# EAGLE schematic ControlModule-pan (EAGLE 7.2.0)
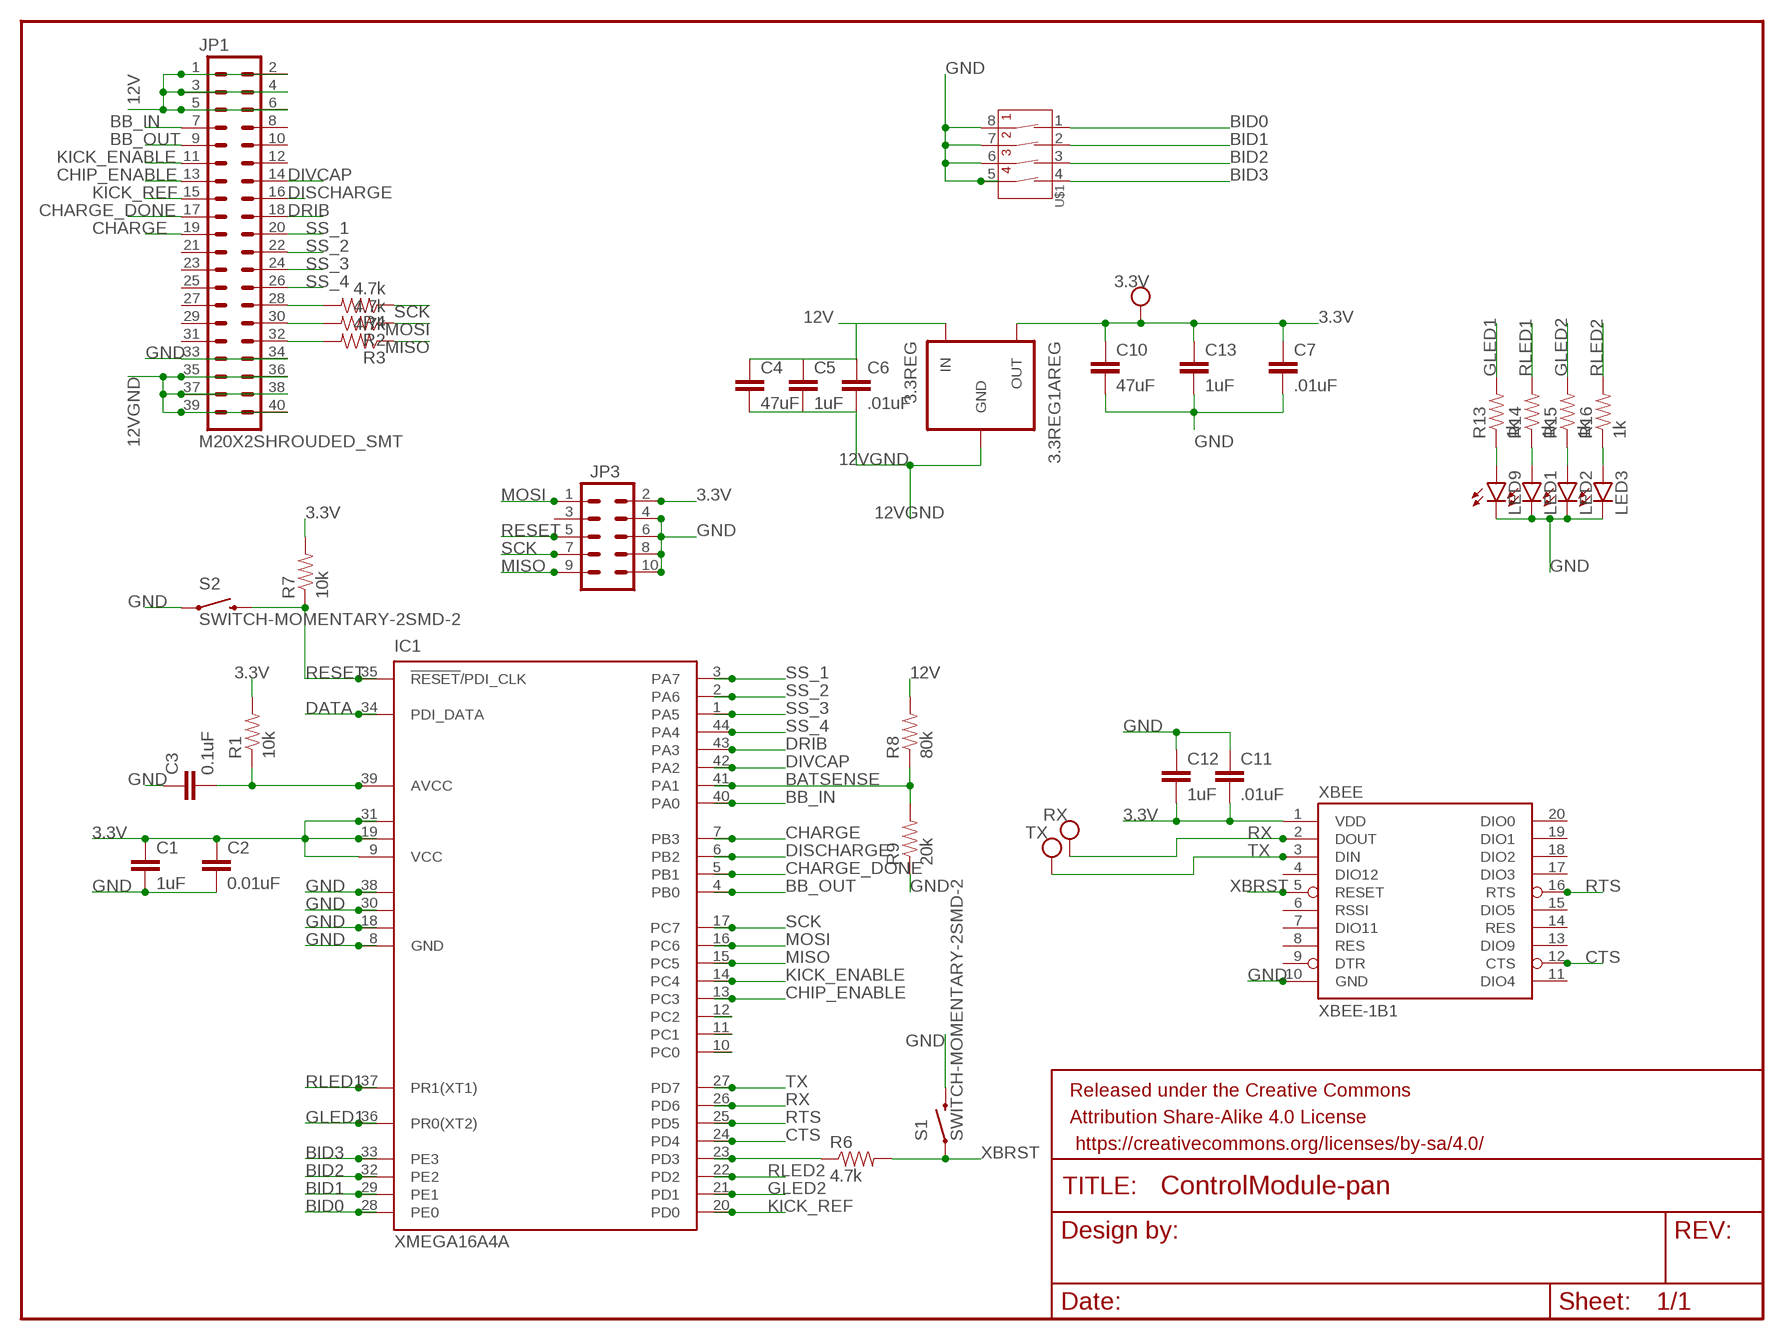
[diagram p0: schematic, sheet 1]

## Parts
3.3REG  3.3REG1AREG  [DPAK]
3.3V  TEST_PT  [TESTING_PT]
C1  1uF  CAP0805  [0805]
C2  0.01uF  CAP0805  [0805]
C3  0.1uF  CAP0805  [0805]
C4  47uF  CAP1206  [1206]
C5  1uF  CAP0805  [0805]
C6  .01uF  CAP0805  [0805]
C7  .01uF  CAP0805  [0805]
C10  47uF  CAP1206  [1206]
C11  .01uF  CAP0805  [0805]
C12  1uF  CAP0805  [0805]
C13  1uF  CAP0805  [0805]
FRAME1  FRAME-LETTER  [CREATIVE_COMMONS]
IC1  XMEGA16A4A  [TQFP44]
JP1  M20X2SHROUDED_SMT  [2X20_SHROUDED_SMT]
JP3  M05X2SHD  [2X5-SHROUDED]
LED1  LED1206  [LED-1206]
LED2  LED1206  [LED-1206]
LED3  LED1206  [LED-1206]
LED9  LED1206  [LED-1206]
R1  10k  RESISTOR0805-RES  [0805]
R2  4.7k  RESISTOR0805-RES  [0805]
R3  4.7k  RESISTOR0805-RES  [0805]
R4  4.7k  RESISTOR0805-RES  [0805]
R6  4.7k  RESISTOR0805-RES  [0805]
R7  10k  RESISTOR0805-RES  [0805]
R8  80k  RESISTOR0805-RES  [0805]
R9  20k  RESISTOR0805-RES  [0805]
R13  1k  RESISTOR0805-RES  [0805]
R14  1k  RESISTOR0805-RES  [0805]
R15  1k  RESISTOR0805-RES  [0805]
R16  1k  RESISTOR0805-RES  [0805]
RX  TEST_PT  [TESTING_PT]
S1  SWITCH-MOMENTARY-2SMD-2  [TACTILE_SWITCH_SMD-2]
S2  SWITCH-MOMENTARY-2SMD-2  [TACTILE_SWITCH_SMD-2]
TX  TEST_PT  [TESTING_PT]
U$1  4-POS-DIP  [4-POS-DIP-SMD]
XBEE  XBEE-1B1  [XBEE-1]

## Nets
3.3V: 3.3REG.SOURCE(OUT) 3.3V.P$1 C1.1 C2.1 C7.1 C10.1 C11.2 C12.2 C13.1 IC1.9(VCC) IC1.19(VCC1) IC1.31(VCC2) JP3.2 R1.2 R7.2 XBEE.1(VDD)
12V: 3.3REG.GATE(IN) C4.1 C5.1 C6.1 JP1.1 JP1.2 JP1.3 JP1.4 JP1.5 JP1.6 R8.2
12VGND: 3.3REG.DRAIN(GND) C4.2 C5.2 C6.2 JP1.35 JP1.36 JP1.37 JP1.38 JP1.39 JP1.40
BATSENSE: IC1.41(PA1) R8.1 R9.2
BB_IN: IC1.40(PA0) JP1.7
BB_OUT: IC1.4(PB0) JP1.9
BID0: IC1.28(PE0) U$1.1(1A)
BID1: IC1.29(PE1) U$1.2(2A)
BID2: IC1.32(PE2) U$1.3(3A)
BID3: IC1.33(PE3) U$1.4(4A)
CHARGE: IC1.7(PB3) JP1.19
CHARGE_DONE: IC1.5(PB1) JP1.17
CHIP_ENABLE: IC1.13(PC3) JP1.13
CTS: IC1.24(PD4) XBEE.12(CTS)
DATA: IC1.34(PDI_DATA)
DISCHARGE: IC1.6(PB2) JP1.16
DIVCAP: IC1.42(PA2) JP1.14
DRIB: IC1.43(PA3) JP1.18
GLED1: IC1.36(PR0(XT2)) R13.2
GLED2: IC1.21(PD1) R15.2
GND: C1.2 C2.2 C3.1 C7.2 C10.2 C11.1 C12.1 C13.2 IC1.8(GND) IC1.18(GND1) IC1.30(GND2) IC1.38(GND3) JP1.33 JP1.34 JP3.4 JP3.6 JP3.8 JP3.10 LED1.C LED2.C LED3.C LED9.C R9.1 S1.1 S2.2 U$1.5(4B) U$1.6(3B) U$1.7(2B) U$1.8(1B) XBEE.10(GND)
INT: IC1.12(PC2)
KICK_ENABLE: IC1.14(PC4) JP1.11
KICK_REF: IC1.20(PD0) JP1.15
MISO: IC1.15(PC5) JP3.9 R3.1
MOSI: IC1.16(PC6) JP3.1 R2.1
N$1: C3.2 IC1.39(AVCC) R1.1
N$2: LED9.A R13.1
N$5: IC1.23(PD3) R6.1
N$6: JP1.30 R2.2
N$7: JP1.32 R3.2
N$8: JP1.28 R4.2
N$9: LED1.A R14.1
N$10: LED2.A R15.1
N$11: LED3.A R16.1
RESET: IC1.35(!RESET!/PDI_CLK) JP3.5 R7.1 S2.1
RLED1: IC1.37(PR1(XT1)) R14.2
RLED2: IC1.22(PD2) R16.2
RTS: IC1.25(PD5) XBEE.16(RTS)
RX: IC1.26(PD6) RX.P$1 XBEE.2(DOUT)
SCK: IC1.17(PC7) JP3.7 R4.1
SCL: IC1.11(PC1)
SDA: IC1.10(PC0)
SS_1: IC1.3(PA7) JP1.20
SS_2: IC1.2(PA6) JP1.22
SS_3: IC1.1(PA5) JP1.24
SS_4: IC1.44(PA4) JP1.26
TX: IC1.27(PD7) TX.P$1 XBEE.3(DIN)
XBRST: R6.2 S1.2 XBEE.5(RESET)
Unconnected: JP1.8 JP1.10 JP1.12 JP1.21 JP1.23 JP1.25 JP1.27 JP1.29 JP1.31 JP3.3 XBEE.4(DIO12) XBEE.6(RSSI) XBEE.7(DIO11) XBEE.8(RES) XBEE.9(DTR) XBEE.11(DIO4) XBEE.13(DIO9) XBEE.14(RES) XBEE.15(DIO5) XBEE.17(DIO3) XBEE.18(DIO2) XBEE.19(DIO1) XBEE.20(DIO0)

## Library data of the parts
3.3REG = gen3:3.3REG1A
3.3V RX TX = gen3:TEST_PT: Testing Point Use to probe a signal
C1-C7 C10-C13 = SparkFun-Capacitors:CAP: Capacitor Standard 0603 ceramic capacitor, and 0.1" leaded capacitor.
FRAME1 = SparkFun-Aesthetics:FRAME-LETTER: Schematic Frame Standard 8.5x11 US Letter frame
IC1 = atmel:XMEGA16A4: MICROCONTROLLER Features High-performance, Low-power 8/16-bit AVR XMEGA Microcontroller Non-Volatile Program and Data Memories - 16 KB - 128 KB of In-System Self-Programmable Flash - 4 KB - 8 KB Boot Code Section with Independent Lock Bits - 1 KB - 2 KB EEPROM - 2 KB - 8 KB Internal SRAM Peripheral Features - Four-channel DMA Controller with support for external requests - Eight-channel Event System - Five 16-bit Timer/Counters Three Timer/Counters with 4 Output Compare or Input Capture channels Two Timer/Counters with 2 Output Compare or Input Capture channels High-Resolution Extensions on all Timer/Counters Advanced Waveform Extension on one Timer/Counter - Five USARTs IrDA Extension on one USART - Two Two-Wire Interfaces with dual address match (I2C and SMBus compatible) - Two SPIs (Serial Peripheral Interfaces) peripherals - AES and DES Crypto Engine - 16-bit Real Time Counter with Separate Oscillator - One Twelve-channel, 12-bit, 2 Msps Analog to Digital Converter - One Two-channel, 12-bit, 1 Msps Digital to Analog Converter - Two Analog Comparators with Window compare function - External Interrupts on all General Purpose I/O pins - Programmable Watchdog Timer with Separate On-chip Ultra Low Power Oscillator Special Microcontroller Features - Power-on Reset and Programmable Brown-out Detection - Internal and External Clock Options with PLL - Programmable Multi-level Interrupt Controller - Sleep Modes: Idle, Power-down, Standby, Power-save, Extended Standby - Advanced Programming, Test and Debugging Interfaces PDI (Program and Debug Interface) for programming, test and debugging I/O and Packages - 34 Programmable I/O Lines - 44 - lead TQFP - 44 - pad VQFN/QFN - 49 - ball VFBGA Operating Voltage - 1.6 - 3.6V Speed performance - 0 - 12 MHz @ 1.6 - 3.6V - 0 - 32 MHz @ 2.7 - 3.6V Drawn by Dipl.-Ing. (FH) Robert Siegler Created: 27.05.09; OC_FARNELL: unknown; OC_NEWARK: unknown
JP1 = SparkFun-Connectors:M20X2: 0.1" spaced headers
JP3 = SparkFun-Connectors:M05X2: Header 5x2 Standard 10-pin dual row 0.1" header. Commonly used with AVR-ISP. Use with Spark Fun Electronics SKU: PRT-00778
LED1-LED3 LED9 = SparkFun-LED:LED: LEDs Standard schematic elements and footprints for 5mm, 3mm, 1206, and 0603 sized LEDs. 5mm - Spark Fun Electronics SKU : COM-00529 (and others)
R1 R6-R9 R13-R16 = SparkFun-Passives:RESISTOR: Resistor Basic schematic elements and footprints for 0603, 1206, and PTH resistors.
R2-R4 = SparkFun-Resistors:RESISTOR: Resistor Basic schematic elements and footprints for 0603, 1206, and PTH resistors.
S1 S2 = SparkFun-Electromechanical:SWITCH-MOMENTARY-2: Various NO switches- pushbuttons, reed, etc
U$1 = SparkFun-Electromechanical:4-POS-DIP: 4 Position DIP Switch CTS series 219; PROD_ID: SWCH-12418
XBEE = SparkFun-RF:XBEE-1: Xbee module footprints SMT header is CONN-09042.